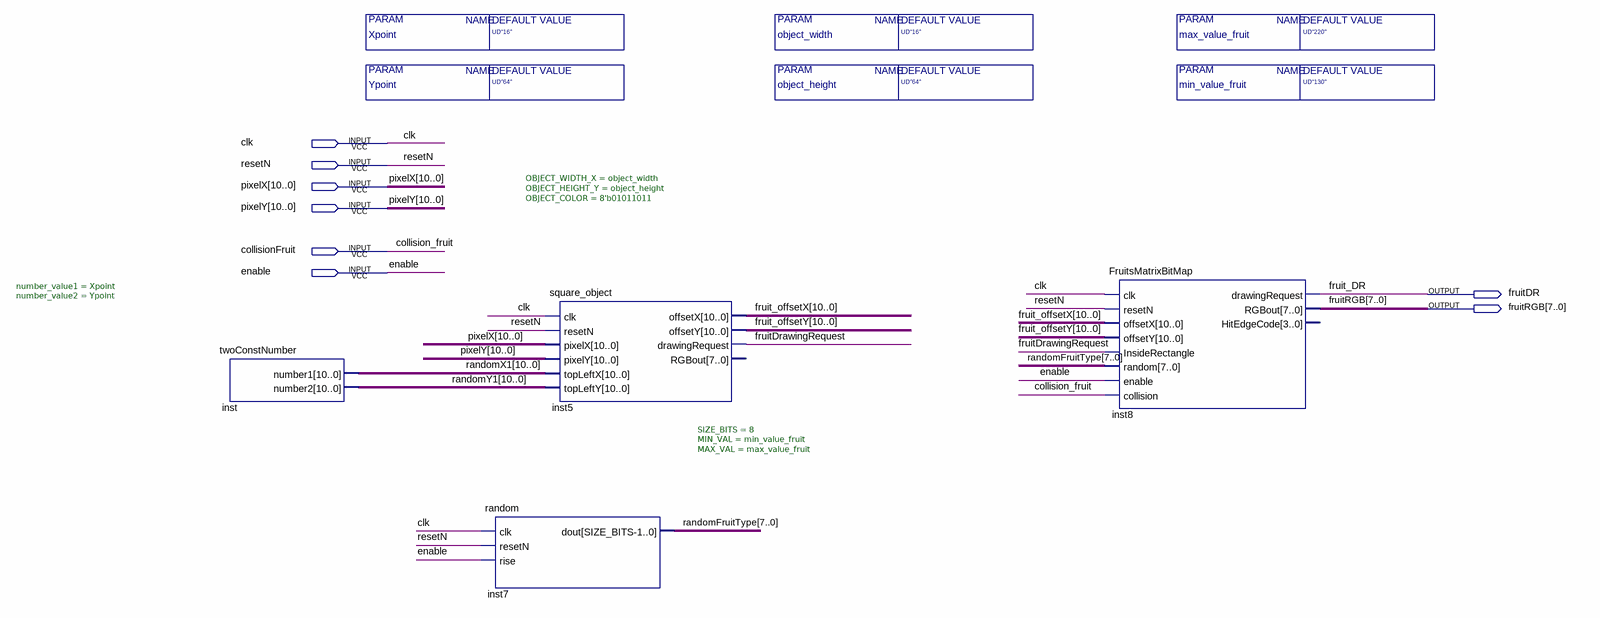
[diagram p0: schematic sheet]
// Quartus schematic fruitOnRope.bdf as structural Verilog: 4 symbols, 8 pins
module fruitOnRope #(parameter object_width = "UD\"16\"", parameter object_height = "UD\"64\"", parameter Xpoint = "UD\"16\"", parameter Ypoint = "UD\"64\"", parameter max_value_fruit = "UD\"220\"", parameter min_value_fruit = "UD\"130\"") (
  input  clk,
  input  resetN,
  input  [10:0] pixelX,
  input  [10:0] pixelY,
  input  collisionFruit,
  input  enable,
  output fruitDR,
  output [7:0] fruitRGB
);

  wire fruitDrawingRequest;
  wire [7:0] randomFruitType;
  wire [10:0] fruit_offsetX, fruit_offsetY, randomX1, randomY1;

  twoConstNumber #(.number_value1(Xpoint), .number_value2(Ypoint)) inst (.number1(randomX1), .number2(randomY1));
  random #(.SIZE_BITS(8), .MIN_VAL(min_value_fruit), .MAX_VAL(max_value_fruit)) inst7 (
    .clk(clk), .resetN(resetN), .rise(enable), .dout(randomFruitType));
  square_object #(.OBJECT_WIDTH_X(object_width), .OBJECT_HEIGHT_Y(object_height), .OBJECT_COLOR(8'b01011011)) inst5 (
    .clk(clk), .resetN(resetN), .pixelX(pixelX), .pixelY(pixelY), .topLeftX(randomX1), .topLeftY(randomY1),
    .offsetX(fruit_offsetX), .offsetY(fruit_offsetY), .drawingRequest(fruitDrawingRequest));  // open: RGBout
  FruitsMatrixBitMap inst8 (
    .clk(clk), .resetN(resetN), .offsetX(fruit_offsetX), .offsetY(fruit_offsetY),
    .InsideRectangle(fruitDrawingRequest), .random(randomFruitType), .enable(enable),
    .collision(collisionFruit), .drawingRequest(fruitDR), .RGBout(fruitRGB));  // open: HitEdgeCode

  // Other names for the same wires on the sheet: collision_fruit = collisionFruit; fruit_DR = fruitDR
endmodule
